# Altium schematic sheet IC203.schdoc
size 191 x 182 mm
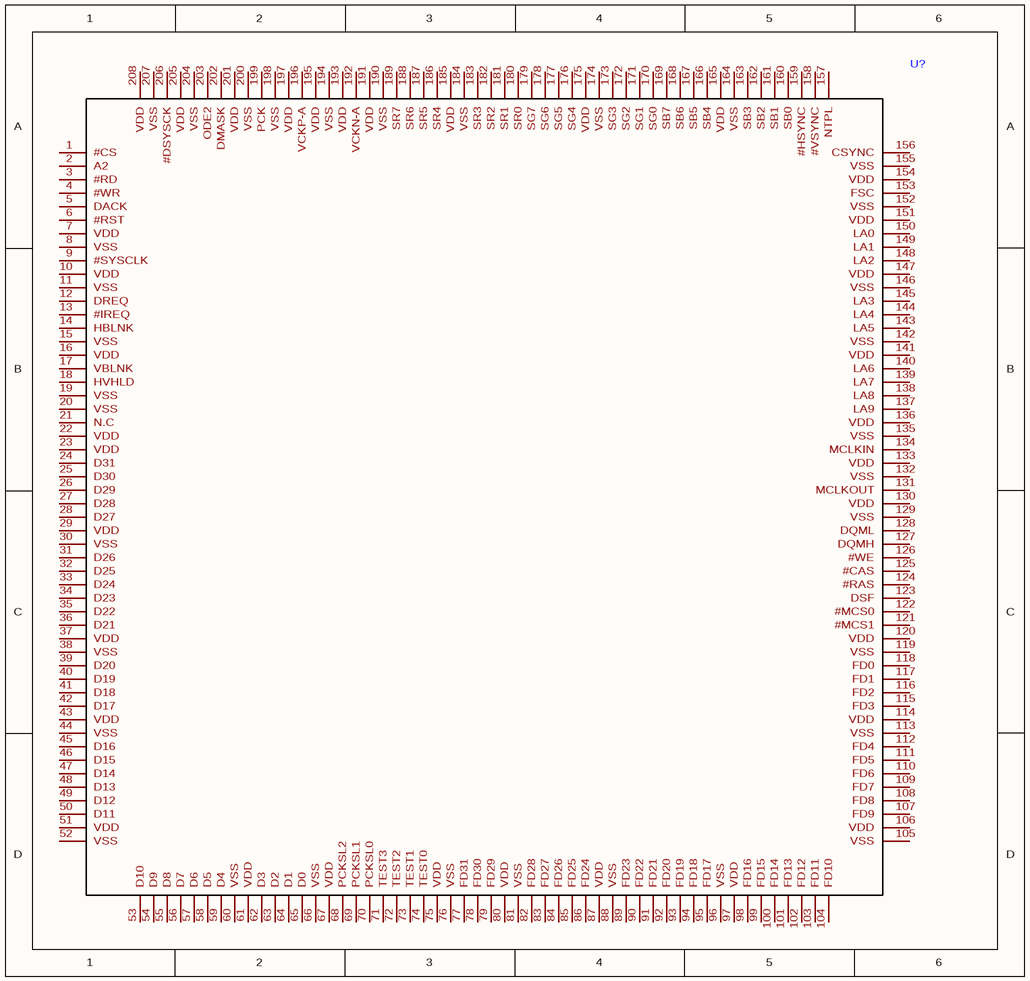
[diagram p0: IC203.schdoc]

## Parts
U?  (no value)  [LQFP-208_L28.0-W28.0-P0.50-LS30.0-BL]

## Nets

Not connected (* = marked no-connect by the designer): U? 1(#CS) 2(A2) 3(#RD) 4(#WR) 5(DACK) 6(#RST) 7(VDD) 8(VSS) 9(#SYSCLK) 10(VDD) 11(VSS) 12(DREQ) 13(#IREQ) 14(HBLNK) 15(VSS) 16(VDD) 17(VBLNK) 18(HVHLD) 19(VSS) 20(VSS) 21(N.C) 22(VDD) 23(VDD) 24(D31) 25(D30) 26(D29) 27(D28) 28(D27) 29(VDD) 30(VSS) 31(D26) 32(D25) 33(D24) 34(D23) 35(D22) 36(D21) 37(VDD) 38(VSS) 39(D20) 40(D19) 41(D18) 42(D17) 43(VDD) 44(VSS) 45(D16) 46(D15) 47(D14) 48(D13) 49(D12) 50(D11) 51(VDD) 52(VSS) 53(D10) 54(D9) 55(D8) 56(D7) 57(D6) 58(D5) 59(D4) 60(VSS) 61(VDD) 62(D3) 63(D2) 64(D1) 65(D0) 66(VSS) 67(VDD) 68(PCKSL2) 69(PCKSL1) 70(PCKSL0) 71(TEST3) 72(TEST2) 73(TEST1) 74(TEST0) 75(VDD) 76(VSS) 77(FD31) 78(FD30) 79(FD29) 80(VDD) 81(VSS) 82(FD28) 83(FD27) 84(FD26) 85(FD25) 86(FD24) 87(VDD) 88(VSS) 89(FD23) 90(FD22) 91(FD21) 92(FD20) 93(FD19) 94(FD18) 95(FD17) 96(VSS) 97(VDD) 98(FD16) 99(FD15) 100(FD14) 101(FD13) 102(FD12) 103(FD11) 104(FD10) 105(VSS) 106(VDD) 107(FD9) 108(FD8) 109(FD7) 110(FD6) 111(FD5) 112(FD4) 113(VSS) 114(VDD) 115(FD3) 116(FD2) 117(FD1) 118(FD0) 119(VSS) 120(VDD) 121(#MCS1) 122(#MCS0) 123(DSF) 124(#RAS) 125(#CAS) 126(#WE) 127(DQMH) 128(DQML) 129(VSS) 130(VDD) 131(MCLKOUT) 132(VSS) 133(VDD) 134(MCLKIN) 135(VSS) 136(VDD) 137(LA9) 138(LA8) 139(LA7) 140(LA6) 141(VDD) 142(VSS) 143(LA5) 144(LA4) 145(LA3) 146(VSS) 147(VDD) 148(LA2) 149(LA1) 150(LA0) 151(VDD) 152(VSS) 153(FSC) 154(VDD) 155(VSS) 156(CSYNC) 157(NTPL) 158(#VSYNC) 159(#HSYNC) 160(SB0) 161(SB1) 162(SB2) 163(SB3) 164(VSS) 165(VDD) 166(SB4) 167(SB5) 168(SB6) 169(SB7) 170(SG0) 171(SG1) 172(SG2) 173(SG3) 174(VSS) 175(VDD) 176(SG4) 177(SG5) 178(SG6) 179(SG7) 180(SR0) 181(SR1) 182(SR2) 183(SR3) 184(VSS) 185(VDD) 186(SR4) 187(SR5) 188(SR6) 189(SR7) 190(VSS) 191(VDD) 192(VCKN-A) 193(VDD) 194(VSS) 195(VDD) 196(VCKP-A) 197(VDD) 198(VSS) 199(PCK) 200(VSS) 201(VDD) 202(DMASK) 203(ODE2) 204(VSS) 205(VDD) 206(#DSYSCK) 207(VSS) 208(VDD)

## Library data of the parts
U? = IC203